# Altium schematic sheet NG2092_QWIIC.SchDoc: =project_title
size Tabloid; CompanyName: Luxonis Holding; Organization: Luxonis Holding; Address1: 1925 Harmony Park Drive; Address2: Westminster, CO; Address3: 80234; Address4: United States; SheetNumber: 11; SheetTotal: 12
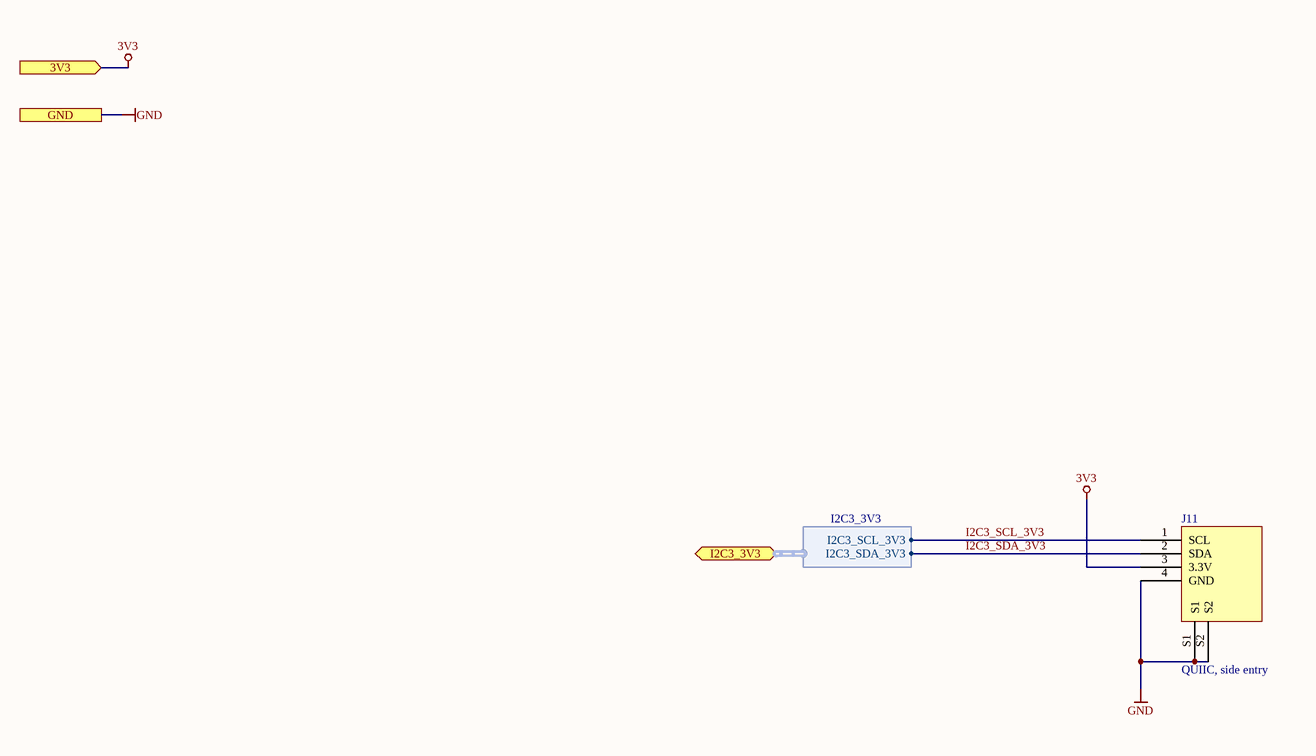
[diagram p0: NG2092_QWIIC.SchDoc]

## Parts
J11  QUIIC, side entry  [SM04B-SRSS-TB(LF)(SN)]

## Ports
3V3 (in), GND, I2C3_3V3 (bidir, harness I2C3_3V3)

## Harnesses
I2C3_3V3: I2C3_SCL_3V3, I2C3_SDA_3V3

## Nets
3V3: J11.3(3.3V) ; port 3V3
GND: J11.4(GND) J11.S1 J11.S2 ; port GND
I2C3_SCL_3V3: J11.1(SCL) ; port I2C3_3V3.I2C3_SCL_3V3
I2C3_SDA_3V3: J11.2(SDA) ; port I2C3_3V3.I2C3_SDA_3V3

## Notes on the sheet
- Title
- Size:
- Date:
- Tabloid
- Number:
- Time:
- Revision:
- Sheet
- of
- Drawn by:

## Library data of the parts
J11 = SM04B-SRSS-TB(LF)(SN): Connector Header, Side Entry, SR Series, 4 Position, 1.00mm, 50V, Surface Mount, Tin, Natural; Manufacturer 1: JST; Number of Positions: 4; Connector Type: Male Pin; Contact Resistance: 40mR; Max Current Rating: 1A; Pitch: 0.039inch; Supplier 1: Digi-Key; Manufacturer Part Number 1: SM04B-SRSS-TB(LF)(SN); Category: Connectors; Stock 1: 79203; Pricing 1: 1=0.61000, 10=0.56900, 100=0.43600, 500=0.37914, 1000=0.31279 (USD); Mount: Surface Mount; Contact Material: Copper Alloy; Contact Plating: Tin; Color: Natural; Housing Material: Polyamide; Housing Color: Beige; Min Operating Temperature: -25°C; Max Operating Temperature: 85°C; Number of Rows: 1; Termination: Solder; Packaging: Tape and Reel; Orientation: Right Angle; Number of Contacts: 4; Max Voltage Rating (AC): 50V; Max Voltage Rating (DC): 50V; Length: 6mm; Depth: 4.95mm; Lead Free: Lead Free; ComponentLink1URL: https://datasheet.ciiva.com/26894/getdatasheetpartid-499363-26894945.pdf?src-supplier=Verical; ComponentLink1Description: https://datasheet.ciiva.com/26894/getdatasheetpartid-499363-26894945.pdf?src-supplier=Verical; ComponentLink2URL: https://datasheet.ciiva.com/26894/getdatasheetpartid-640736-26894676.pdf?src-supplier=Verical; ComponentLink2Description: https://datasheet.ciiva.com/26894/getdatasheetpartid-640736-26894676.pdf?src-supplier=Verical; ComponentLink3URL: https://datasheet.ciiva.com/16487/jstsm04b-srss-tb-lf-sn-16487222.pdf?src-supplier=Future+Electronics; ComponentLink3Description: https://datasheet.ciiva.com/16487/jstsm04b-srss-tb-lf-sn-16487222.pdf?src-supplier=Future+Electronics; ComponentLink4URL: http://datasheet.octopart.com/SM04B-SRSS-TB%28LF%29%28SN%29-JST-datasheet-65849987.pdf?src-supplier=Newark; ComponentLink4Description: http://datasheet.octopart.com/SM04B-SRSS-TB%28LF%29%28SN%29-JST-datasheet-65849987.pdf?src-supplier=Newark; ComponentLink5URL: http://datasheet.octopart.com/SM04B-SRSS-TB%28LF%29%28SN%29-JST-datasheet-8330955.pdf?src-supplier=Upverter; ComponentLink5Description: http://datasheet.octopart.com/SM04B-SRSS-TB%28LF%29%28SN%29-JST-datasheet-8330955.pdf?src-supplier=Upverter; ComponentLink6URL: http://datasheet.octopart.com/SM04B-SRSS-TB%28LF%29%28SN%29-JST-datasheet-12489618.pdf?src-supplier=Upverter; ComponentLink6Description: http://datasheet.octopart.com/SM04B-SRSS-TB%28LF%29%28SN%29-JST-datasheet-12489618.pdf?src-supplier=Upverter; ComponentLink7URL: http://datasheet.octopart.com/SM04B-SRSS-TB%28LF%29%28SN%29-JST-datasheet-119911.pdf?src-supplier=Digi-Key; ComponentLink7Description: http://datasheet.octopart.com/SM04B-SRSS-TB%28LF%29%28SN%29-JST-datasheet-119911.pdf?src-supplier=Digi-Key; ComponentLink8URL: http://datasheet.octopart.com/SM04B-SRSS-TB%28LF%29%28SN%29-JST-datasheet-120967.pdf?src-supplier=Future+Electronics; ComponentLink8Description: http://datasheet.octopart.com/SM04B-SRSS-TB%28LF%29%28SN%29-JST-datasheet-120967.pdf?src-supplier=Future+Electronics; Supplier 2: Digi-Key; Supplier 3: Newark; Supplier 4: Future Electronics; Supplier Part Number 1: 455-1804-1-ND; Supplier Part Number 2: 455-1804-2-ND; Supplier Part Number 3: 87R0314; Supplier Part Number 4: SM04B-SRSS-TB(LF)(SN)-CUTT